# EasyEDA Pro project ProPrj_多模式音乐互动旋转控制系统设计_2026-04-17.epro

# Schematic Schematic1
Assembly Variant: Basic; Board Name: Board1; Create Date: 2026-04-17; Page Name: P1; Project Name: 多模式音乐互动旋转控制系统设计; Schematic Name: Schematic1; Update Date: 2026-04-17; BladeWidth: 10; Company: 嘉立创EDA; Page Size: A4; RegionStart: 1; ShowBorder: 1; TitleBlock: 1; TitleBlockPosition: 3; Version: V1.0; XRegionCount: 6; YRegionCount: 4
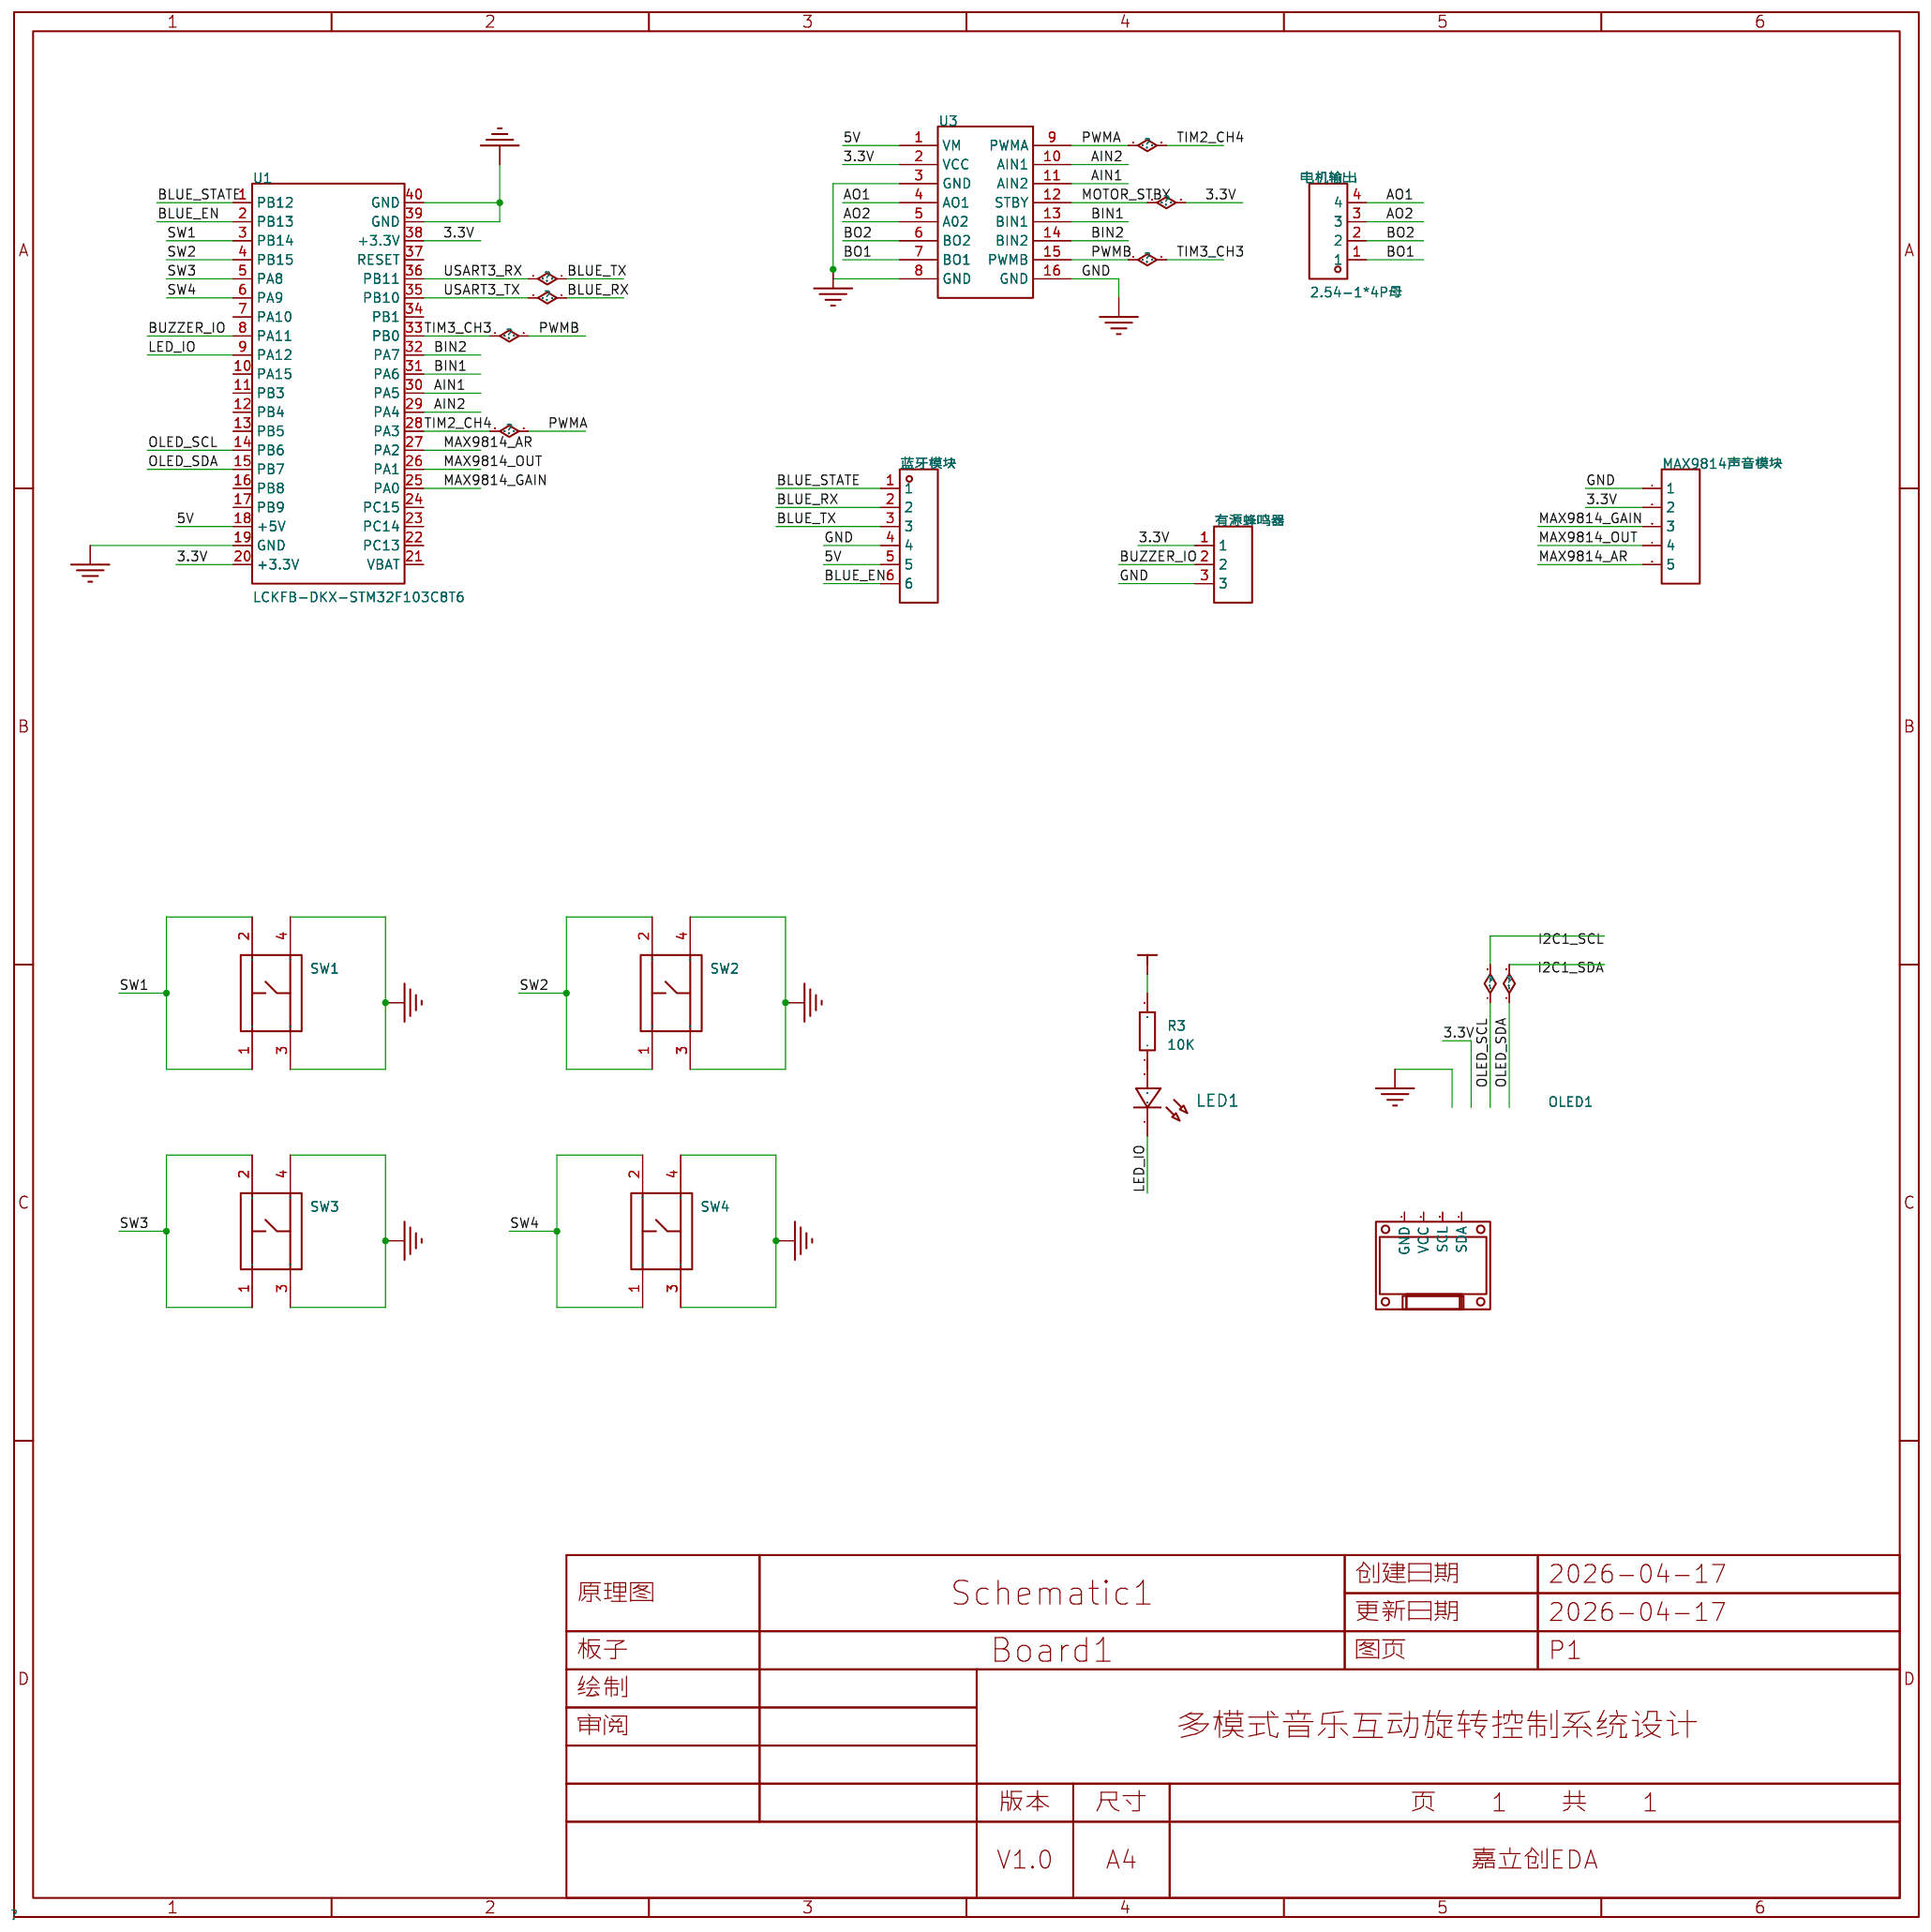
[diagram p0: schematic sheet]

## Parts
LED1  -  [LED_0805]
MAX9814声音模块  -  [HDR-TH_5P-P2.54-V-F]
OLED1  -  [0.96OLED_4P]
R3  10K  [R0805]
SW1  K2-1102DP-C4SW-04  [KEY-TH_4P-L6.0-W6.0-P4.50-LS6.50]
SW2  K2-1102DP-C4SW-04  [KEY-TH_4P-L6.0-W6.0-P4.50-LS6.50]
SW3  K2-1102DP-C4SW-04  [KEY-TH_4P-L6.0-W6.0-P4.50-LS6.50]
SW4  K2-1102DP-C4SW-04  [KEY-TH_4P-L6.0-W6.0-P4.50-LS6.50]
U1  LCKFB-DKX-STM32F103C8T6  [CONN-TH_L53.3-W22.9_STM32F103C8T6-CARD]
U3  -  [TB6612]
有源蜂鸣器  PM254V-11-03-H85  [HDR-TH_3P-P2.54-V-F]
电机输出  2.54-1*4P母  [HDR-TH_4P-P2.54-V-F]
蓝牙模块  -  [HDR-TH_6P-P2.54-V-F]

## Library data of the parts
LED1 = LED_0805-R: Supplier Footprint: 0805
MAX9814声音模块 = HDR-F_2.54_1x5P: Supplier Part: C50950; Supplier Footprint: 插件
OLED1 = 0.96OLED模块_4P: Supplier Footprint: 插件
R3 = Res_0805: Supplier Footprint: 0805
SW1-SW4 = K2-1102DP-C4SW-04: 电路结构:单刀单掷;按钮形状:圆形按钮;作用力:2.5N;安装方式:直插;开关长度:6mm;开关宽度:6mm;开关高度:5mm;触点电流:50mA;额定电压:12V;带灯:-;工作寿命:10万次;; LCSC Part Name: 轻触按键开关6*6*5; Supplier Part: C110153; Manufacturer: 韩国韩荣; Supplier Footprint: 插件-4P,6x6mm; JLCPCB Part Class: Extended Part; Datasheet: https://item.szlcsc.com/datasheet/K2-1102DP-C4SW-04/111374.html; Supplier: LCSC; Circuit: 单刀单掷; Actuator Style: 圆形按钮; Operating Force: 2.5N; Mounting Type: 直插; Length: 6mm; Width: 6mm; Switch Height: 5mm; Contact Current: 50mA; Voltage Rating: 12V; Life: 10万次; Operating Temperature: -25℃~+85℃
U1 = LCKFB-DKX-STM32F103C8T6: 搭载Contex M3内核,程序存储容量64KB,RAM总容量20KB,最高72MHz主频,提供高效的计算能力和稳定的运行环境。; LCSC Part Name: 立创·地阔星-STM32F103C8T6开发板; Supplier Part: C22396880; Manufacturer: 立创开发板; JLCPCB Part Class: Extended Part; Datasheet: https://item.szlcsc.com/datasheet/LCKFB-DKX-STM32F103C8T6/24005615.html; Supplier: LCSC
U3 = TB6612
有源蜂鸣器 = PM254V-11-03-H85: 插孔结构:1x3P;间距:2.54mm;行距:-;圆孔/方孔:方孔;安装方式:直插;排数:单排;总孔位数:3P;额定电流:3A;插孔方向:顶部;塑高:8.5mm;触头材质:黄铜;触头镀层:-;工作温度:-40℃~+105℃;; LCSC Part Name: 1x3P 间距:2.54mm 直插; Supplier Part: C541850; Manufacturer: XFCN(兴飞); Supplier Footprint: 插件,P=2.54mm; JLCPCB Part Class: Extended Part; Datasheet: https://item.szlcsc.com/datasheet/PM254V-11-03-H85/562471.html; Supplier: LCSC; Holes Structure: 1x3P; Pitch: 2.54mm; Circular Hole / Square Hole: 方孔; Mounting Type: 直插; Number of Rows: 单排; Number of Positions: 3P; Current Rating: 3A; Holes Direction: 顶部; Insulation Height: 8.5mm; Contact Material: 黄铜; Operating Temperature: -40℃~+105℃
电机输出 = 2.54-1*4P母: 插孔结构:1x4P;间距:2.54mm;行距:-;圆孔/方孔:方孔;安装方式:直插;排数:单排;总孔位数:4P;额定电流:3A;额定电压:-;插孔方向:顶部;塑高:-;触头材质:青铜;触头镀层:-;工作温度:-40℃~+105℃;; LCSC Part Name: 间距:2.54mm 1x4P 直插; Supplier Part: C2718488; Manufacturer: BOOMELE(博穆精密); Supplier Footprint: 插件,P=2.54mm; JLCPCB Part Class: Extended Part; Datasheet: https://item.szlcsc.com/datasheet/2.54-1*4P%25E6%25AF%258D/2834502.html; Supplier: LCSC; Holes Structure: 1x4P; Pitch: 2.54mm; Circular Hole / Square Hole: 方孔; Mounting Type: 直插; Number of Rows: 单排; Number of Positions: 4P; Current Rating: 3A; Holes Direction: 顶部; Contact Material: 青铜; Operating Temperature: -40℃~+105℃
蓝牙模块 = HDR-F_2.54_1x6P: Supplier Part: C40877; Supplier Footprint: 插件

## Nets
3.3V: MAX9814声音模块.2 R3.2 U1.20(+3.3V) U1.38(+3.3V) U3.2(VCC) U3.12(STBY) 有源蜂鸣器.1
5V: U1.18(+5V) U3.1(VM) 蓝牙模块.5
GND: MAX9814声音模块.1 SW1.3 SW1.4 SW2.3 SW2.4 SW3.3 SW3.4 SW4.3 SW4.4 U1.19(GND) U1.39(GND) U1.40(GND) U3.3(GND) U3.8(GND) U3.16(GND) 有源蜂鸣器.3 蓝牙模块.4
AIN1: U1.30(PA5) U3.11(AIN2)
AIN2: U1.29(PA4) U3.10(AIN1)
AO1: U3.4(AO1) 电机输出.4
AO2: U3.5(A02) 电机输出.3
BIN1: U1.31(PA6) U3.13(BIN1)
BIN2: U1.32(PA7) U3.14(BIN2)
BLUE_EN: U1.2(PB13) 蓝牙模块.6
BLUE_RX: U1.35(PB10) 蓝牙模块.2
BLUE_STATE: U1.1(PB12) 蓝牙模块.1
BLUE_TX: U1.36(PB11) 蓝牙模块.3
BO1: U3.7(BO1) 电机输出.1
BO2: U3.6(BO2) 电机输出.2
BUZZER_IO: U1.8(PA11) 有源蜂鸣器.2
I2C1_SCL: U1.14(PB6)
I2C1_SDA: U1.15(PB7)
LED_IO: LED1.1(C) U1.9(PA12)
MAX9814_AR: MAX9814声音模块.5 U1.27(PA2)
MAX9814_GAIN: MAX9814声音模块.3 U1.25(PA0)
MAX9814_OUT: MAX9814声音模块.4 U1.26(PA1)
PWMA: U1.28(PA3) U3.9(PWMA)
PWMB: U1.33(PB0) U3.15(PWMB)
SW1: SW1.1 SW1.2 U1.3(PB14)
SW2: SW2.1 SW2.2 U1.4(PB15)
SW3: SW3.1 SW3.2 U1.5(PA8)
SW4: SW4.1 SW4.2 U1.6(PA9)
$1N49: LED1.2(A) R3.1

Not connected (* = marked no-connect by the designer): OLED1 1(GND) 2(VCC) 3(SCL) 4(SDA); U1 7(PA10) 10(PA15) 11(PB3) 12(PB4) 13(PB5) 16(PB8) 17(PB9) 21(VBAT) 22(PC13) 23(PC14) 24(PC15) 34(PB1) 37(RESET)

# Board PCB1
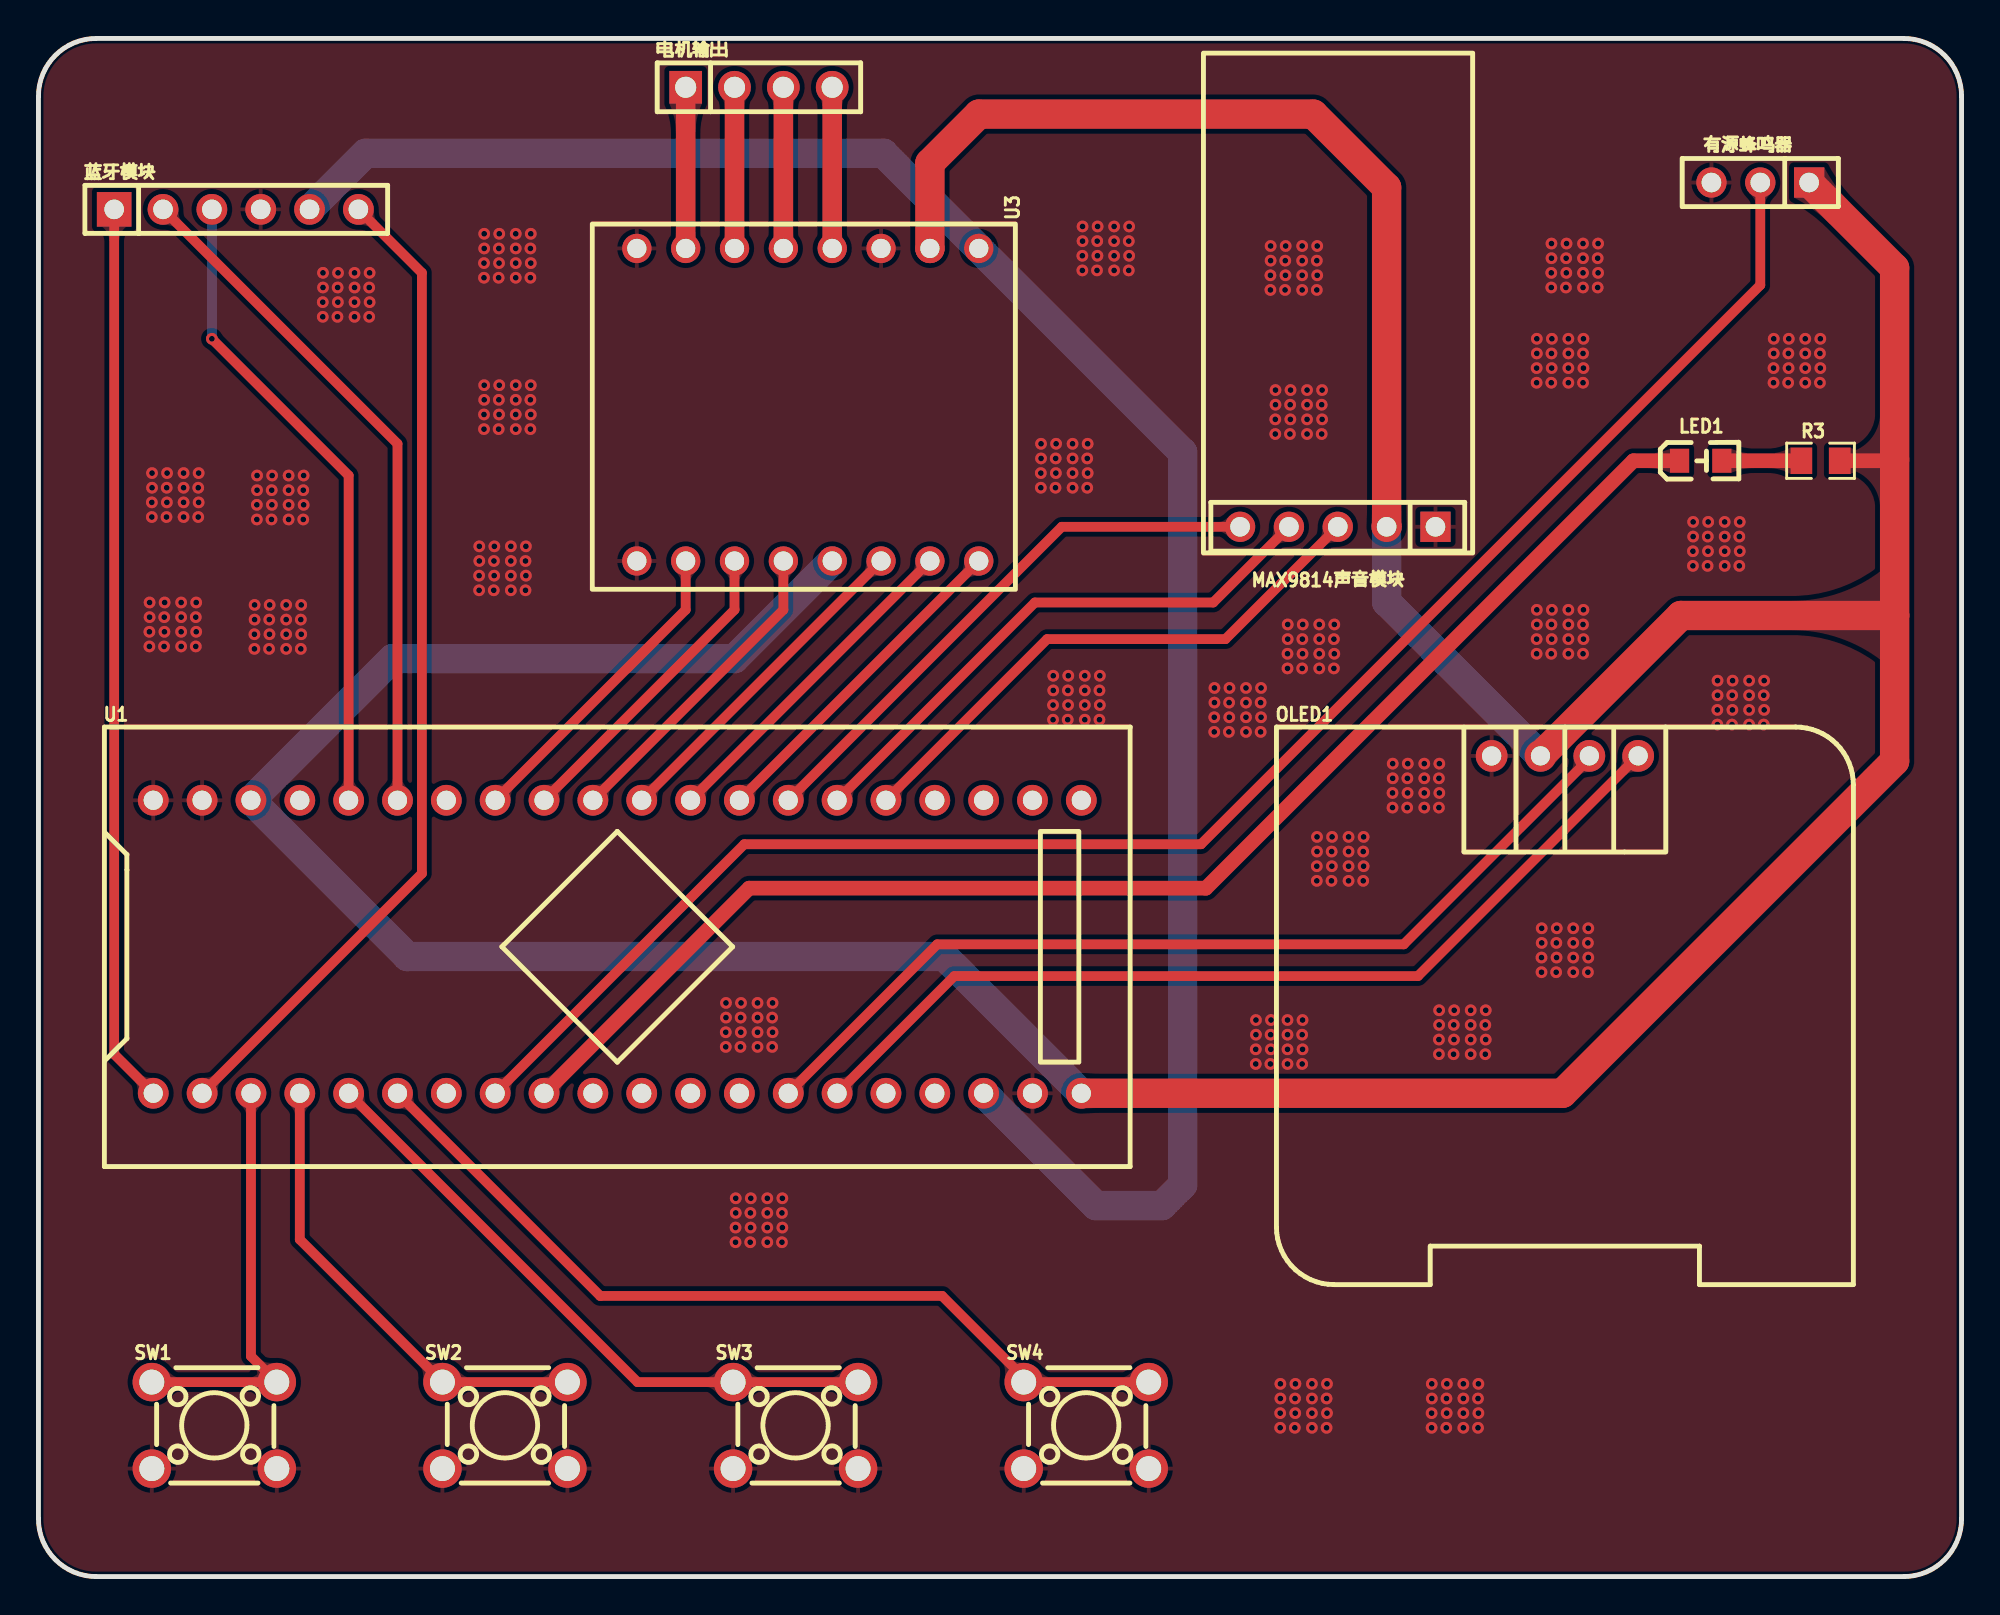
[diagram p1: board, top side]
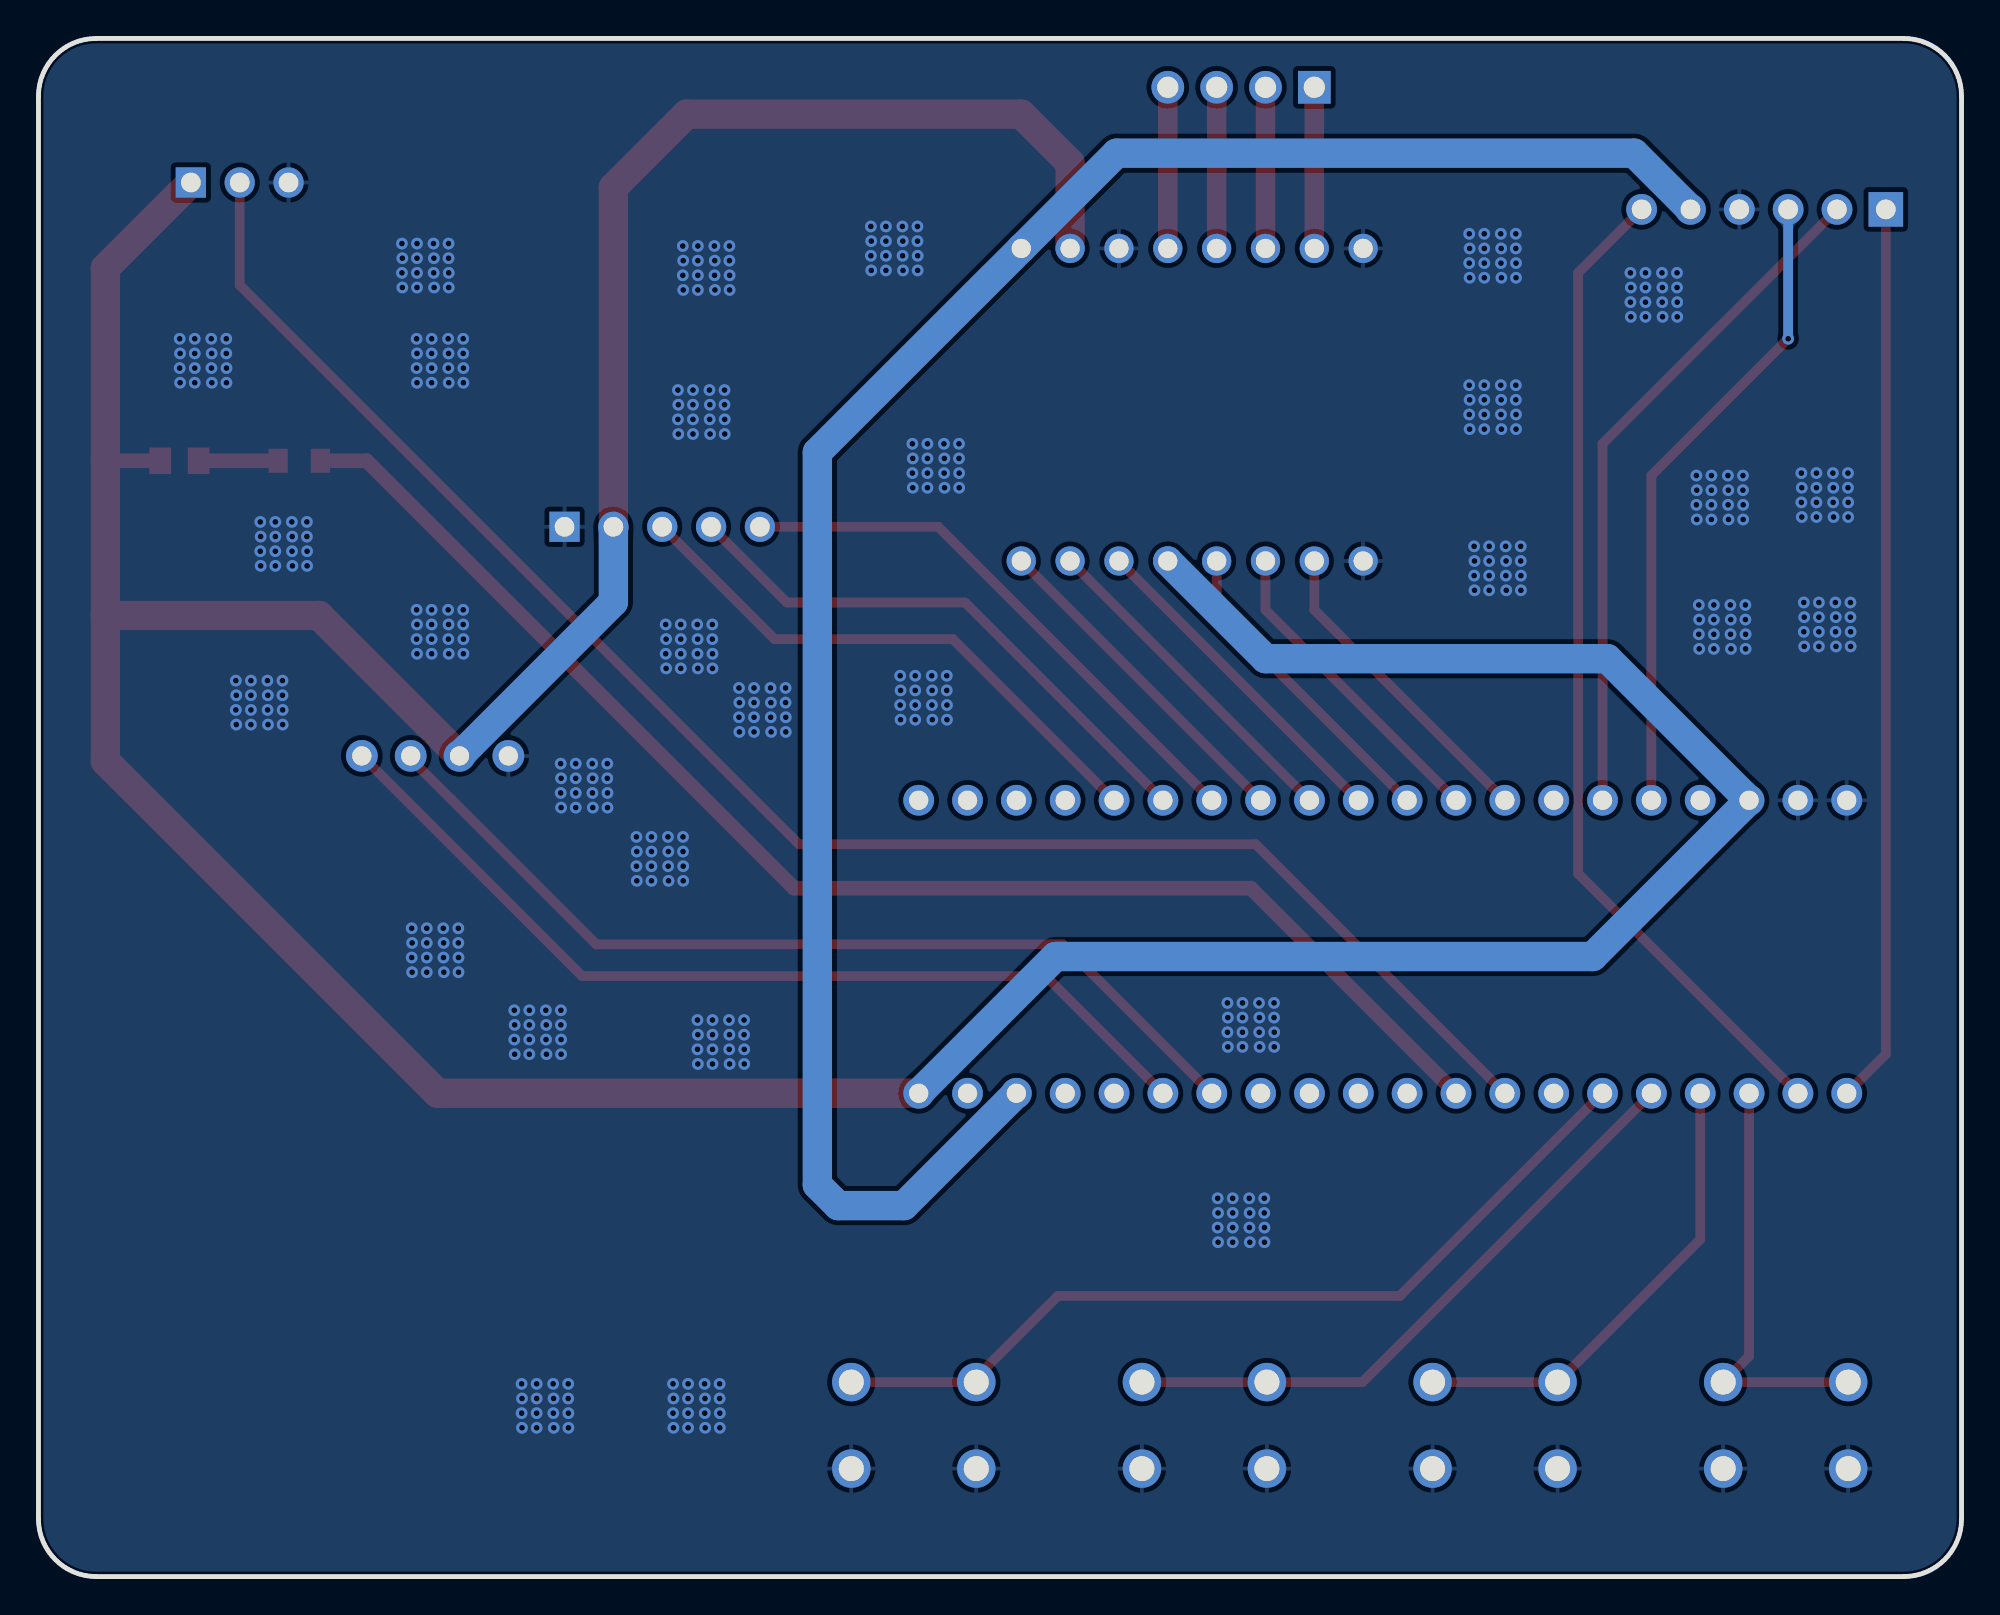
[diagram p2: board, bottom side, seen from below]

Outline 100 x 80 mm; copper layers: Top Layer, Bottom Layer. Coordinates in mm from the lower left corner of the outline.
Outline path: 0,77 0,3 arc(0.88,0.88) 3,0 97,0 arc(99.12,0.88) 100,3 100,77 arc(99.12,79.12) 97,80 3,80 arc(0.88,79.12) 0,77
Stack: Top Layer 0.035mm / Dielectric1 1.51mm FR4 er 4.5 / Bottom Layer 0.035mm

## Design rules (mm)
spacing copperThickness1oz (default): track to track 0.102, other pairs 0.152 to 0.3
spacing copperThickness2oz: track to track 0.203, other pairs 0.152 to 0.3
track width copperThickness1oz (default): min 0.127, default 0.254, max 2.54
track width copperThickness2oz: min 0.203, default 0.254, max 2.54
differential pair differentialPair (default): width min 0.127, default 0.254, max 2.54; gap min 0.152, default 0.152
net GND uses copperRegion

## Placement (name value [footprint] x y rotation side)
LED1  -  [LED_0805]  86.49 58.03 0 top
MAX9814声音模块  -  [HDR-TH_5P-P2.54-V-F]  67.56 54.6 180 top
OLED1  -  [0.96OLED_4P]  79.38 42.68 0 top
R3  10K  [R0805]  92.67 58.03 0 top
SW1  K2-1102DP-C4SW-04  [KEY-TH_4P-L6.0-W6.0-P4.50-LS6.50]  9.14 7.86 0 top
SW2  K2-1102DP-C4SW-04  [KEY-TH_4P-L6.0-W6.0-P4.50-LS6.50]  24.26 7.86 0 top
SW3  K2-1102DP-C4SW-04  [KEY-TH_4P-L6.0-W6.0-P4.50-LS6.50]  39.37 7.86 0 top
SW4  K2-1102DP-C4SW-04  [KEY-TH_4P-L6.0-W6.0-P4.50-LS6.50]  54.48 7.86 0 top
U1  LCKFB-DKX-STM32F103C8T6  [CONN-TH_L53.3-W22.9_STM32F103C8T6-CARD]  30.1 32.76 0 top
U3  -  [TB6612]  50.8 70.35 270 top
有源蜂鸣器  PM254V-11-03-H85  [HDR-TH_3P-P2.54-V-F]  89.53 72.51 180 top
电机输出  2.54-1*4P母  [HDR-TH_4P-P2.54-V-F]  37.47 77.46 0 top
蓝牙模块  -  [HDR-TH_6P-P2.54-V-F]  10.29 71.11 0 top

## Footprints (pads in the part's own frame, mm; a bottom-side part is the same pattern mirrored in y, then rotated)
0.96OLED_4P
  round 1.65 hole 1: 1(-3.81,-0.002) 2(-1.27,0.002) 3(1.27,0.002) 4(3.81,0.002)
CONN-TH_L53.3-W22.9_STM32F103C8T6-CARD
  round 1.6 hole 1: 1(-24.13,-7.62) 2(-21.59,-7.62) 3(-19.05,-7.62) 4(-16.51,-7.62) 5(-13.97,-7.62) 6(-11.43,-7.62) 7(-8.89,-7.62) 8(-6.35,-7.62) 9(-3.81,-7.62) 10(-1.27,-7.62) 11(1.27,-7.62) 12(3.81,-7.62) 13(6.35,-7.62) 14(8.89,-7.62) 15(11.43,-7.62) 16(13.97,-7.62) 17(16.51,-7.62) 18(19.05,-7.62) 19(21.59,-7.62) 20(24.13,-7.62) 21(24.13,7.62) 22(21.59,7.62) 23(19.05,7.62) 24(16.51,7.62) 25(13.97,7.62) 26(11.43,7.62) 27(8.89,7.62) 28(6.35,7.62) 29(3.81,7.62) 30(1.27,7.62) 31(-1.27,7.62) 32(-3.81,7.62) 33(-6.35,7.62) 34(-8.89,7.62) 35(-11.43,7.62) 36(-13.97,7.62) 37(-16.51,7.62) 38(-19.05,7.62) 39(-21.59,7.62) 40(-24.13,7.62)
HDR-TH_3P-P2.54-V-F
  rect 1.575x1.575 hole 1.02: 1(-2.54,0)
  round 1.575 hole 1.02: 2(0,0) 3(2.54,0)
HDR-TH_4P-P2.54-V-F
  rect 1.7x1.7 hole 1.1: 1(-3.81,0)
  round 1.7 hole 1.1: 2(-1.27,0) 3(1.27,0) 4(3.81,0)
HDR-TH_5P-P2.54-V-F
  rect 1.575x1.575 hole 1.02: 1(-5.08,0)
  round 1.575 hole 1.02: 2(-2.54,0) 3(0,0) 4(2.54,0) 5(5.08,0)
HDR-TH_6P-P2.54-V-F
  rect 1.8x1.8 hole 1.02: 1(-6.35,0)
  round 1.6 hole 1.02: 2(-3.81,0) 3(-1.27,0) 4(1.27,0) 5(3.81,0) 6(6.35,0)
KEY-TH_4P-L6.0-W6.0-P4.50-LS6.50
  round 2 hole 1.3: 1(-3.25,2.25) 2(3.25,2.25) 3(-3.25,-2.25) 4(3.25,-2.25)
LED_0805
  rect 1x1.25 smd: 1(-1.15,0.005) 2(1.05,0.005)
R0805
  rect 1.133x1.377 smd: 1(-1,0) 2(1,0)
TB6612
  round 1.524 hole 1: 1(1.27,-1.905) 2(1.27,-4.445) 3(1.27,-6.985) 4(1.27,-9.525) 5(1.27,-12.065) 6(1.27,-14.605) 7(1.27,-17.145) 8(1.27,-19.685) 9(17.526,-1.905) 10(17.526,-4.445) 11(17.526,-6.985) 12(17.526,-9.525) 13(17.526,-12.065) 14(17.526,-14.605) 15(17.526,-17.145) 16(17.526,-19.685)

## Nets
As in the schematic, except:
3.3V: MAX9814声音模块.2 OLED1.2 R3.2 U1.20 U1.38 U3.2 U3.12 有源蜂鸣器.1
GND: MAX9814声音模块.1 OLED1.1 SW1.3 SW1.4 SW2.3 SW2.4 SW3.3 SW3.4 SW4.3 SW4.4 U1.19 U1.39 U1.40 U3.3 U3.8 U3.16 有源蜂鸣器.3 蓝牙模块.4
I2C1_SCL: OLED1.3 U1.14
I2C1_SDA: OLED1.4 U1.15

Pads without a net: U1 7 10 11 12 13 16 17 21 22 23 24 34 37

## Via types
v1: diameter 0.61, hole 0.305, Top Layer to Bottom Layer, 481 vias

## Routing (per net, layer and track width the routed paths; a pad name or vN(x,y) marks a point on that pad's centre or on a via; arc(x,y) is an arc through that point)
3.3V: length 254.3
  Top Layer w0.762: 96.52,58.1 96.46,58.03 R3.2
  Top Layer w1.524: OLED1.2 85.41,49.99 96.52,49.99 ; U3.2 46.35,73.52 48.9,76.06 66.29,76.06 70.1,72.25 MAX9814声音模块.2 ; 有源蜂鸣器.1 96.52,68.06 96.52,49.99 ; 96.52,49.99 96.52,42.41 79.25,25.14 U1.20
  Bottom Layer w1.524: U3.12 36.19,47.74 18.42,47.74 U1.38 19.18,32.25 47.12,32.25 U1.20 ; OLED1.2 70.1,50.69 MAX9814声音模块.2
5V: length 104.4
  Bottom Layer w1.524: 14.1,71.11 17.02,74.03 43.94,74.03 U3.1 59.5,58.48 59.5,20.37 58.42,19.29 54.99,19.29 U1.18
GND:
  vias: v1(5.78,50.66) v1(5.78,49.9) v1(5.77,49.14) v1(5.77,48.38) v1(5.91,57.39) v1(5.91,56.63) v1(5.89,55.87) v1(5.89,55.11) v1(6.54,49.9) v1(6.53,48.38) v1(6.56,50.66) v1(6.55,49.14) v1(6.69,57.39) v1(6.67,56.63) v1(6.68,55.87) v1(6.66,55.11) v1(7.42,50.66) v1(7.42,49.9) v1(7.42,49.14) v1(7.42,48.38) v1(7.55,57.39) v1(7.55,56.63) v1(7.55,55.87) v1(7.55,55.11) v1(8.2,50.66) v1(8.18,49.9) v1(8.2,49.14) v1(8.18,48.38) v1(8.33,57.39) v1(8.31,56.63) v1(8.33,55.87) v1(8.31,55.11) v1(11.24,50.54) v1(11.24,49.77) v1(11.23,49.01) v1(11.23,48.25) v1(11.37,57.27) v1(11.37,56.5) v1(11.36,55.74) v1(11.36,54.98) v1(12.02,50.54) v1(12,49.77) v1(12.01,49.01) v1(11.99,48.25) v1(12.15,57.27) v1(12.13,56.5) v1(12.14,55.74) v1(12.12,54.98) v1(12.88,50.54) v1(12.88,49.77) v1(12.88,49.01) v1(12.88,48.25) v1(13.01,57.27) v1(13.01,56.5) v1(13.01,55.74) v1(13.01,54.98) v1(13.64,49.77) v1(13.64,48.25) v1(13.66,50.54) v1(13.66,49.01) v1(13.79,57.27) v1(13.77,56.5) v1(13.79,55.74) v1(13.77,54.98) v1(14.8,67.81) v1(14.8,67.05) v1(14.78,66.28) v1(14.78,65.52) v1(15.55,65.52) v1(15.58,67.81) v1(15.56,67.05) v1(15.57,66.28) v1(16.44,67.81) v1(16.44,67.05) v1(16.44,66.28) v1(16.44,65.52) v1(17.22,67.81) v1(17.2,67.05) v1(17.22,66.28) v1(17.2,65.52) v1(22.92,53.58) v1(22.92,52.82) v1(22.91,52.06) v1(22.91,51.3) v1(23.18,69.84) v1(23.18,69.08) v1(23.17,68.32) v1(23.17,67.55) v1(23.18,61.97) v1(23.18,61.2) v1(23.17,60.44) v1(23.17,59.68) v1(23.71,53.58) v1(23.69,52.82) v1(23.7,52.06) v1(23.67,51.3) v1(23.94,69.08) v1(23.93,67.55) v1(23.94,61.2) v1(23.93,59.68) v1(23.96,69.84) v1(23.95,68.32) v1(23.96,61.97) v1(23.95,60.44) v1(24.56,53.58) v1(24.56,52.82) v1(24.56,52.06) v1(24.56,51.3) v1(24.82,69.84) v1(24.82,69.08) v1(24.82,68.32) v1(24.82,67.55) v1(24.82,61.97) v1(24.82,61.2) v1(24.82,60.44) v1(24.82,59.68) v1(25.35,53.58) v1(25.33,52.82) v1(25.35,52.06) v1(25.33,51.3) v1(25.6,69.84) v1(25.58,69.08) v1(25.6,68.32) v1(25.58,67.55) v1(25.6,61.97) v1(25.58,61.2) v1(25.6,60.44) v1(25.58,59.68) v1(35.74,28.31) v1(35.74,27.55) v1(35.75,29.83) v1(35.75,29.07) v1(36.25,18.15) v1(36.25,17.39) v1(36.26,19.68) v1(36.26,18.91) v1(36.53,29.83) v1(36.51,29.07) v1(36.52,28.31) v1(36.5,27.55) v1(37.04,19.68) v1(37.02,18.91) v1(37.03,18.15) v1(37.01,17.39) v1(37.39,29.83) v1(37.39,29.07) v1(37.39,28.31) v1(37.39,27.55) v1(37.9,19.68) v1(37.9,18.91) v1(37.9,18.15) v1(37.9,17.39) v1(38.17,29.83) v1(38.15,29.07) v1(38.17,28.31) v1(38.15,27.55) v1(38.68,19.68) v1(38.66,18.91) v1(38.68,18.15) v1(38.66,17.39) v1(52.13,58.92) v1(52.13,58.16) v1(52.12,57.39) v1(52.12,56.63) v1(52.77,46.85) v1(52.77,46.09) v1(52.76,45.33) v1(52.76,44.57) v1(52.92,58.92) v1(52.9,58.16) v1(52.91,57.39) v1(52.88,56.63) v1(53.53,46.09) v1(53.54,45.33) v1(53.52,44.57) v1(53.55,46.85) v1(53.77,58.92) v1(53.77,58.16) v1(53.77,57.39) v1(53.77,56.63) v1(54.29,70.22) v1(54.29,69.46) v1(54.28,68.7) v1(54.28,67.94) v1(54.41,46.85) v1(54.41,46.09) v1(54.41,45.33) v1(54.41,44.57) v1(54.54,58.16) v1(54.54,56.63) v1(54.56,58.92) v1(54.56,57.39) v1(55.04,67.94) v1(55.08,70.22) v1(55.05,69.46) v1(55.06,68.7) v1(55.19,46.85) v1(55.17,46.09) v1(55.19,45.33) v1(55.17,44.57) v1(55.93,70.22) v1(55.93,69.46) v1(55.93,68.7) v1(55.93,67.94) v1(56.72,70.22) v1(56.69,69.46) v1(56.72,68.7) v1(56.69,67.94) v1(61.14,44.69) v1(61.14,43.93) v1(61.15,46.22) v1(61.15,45.46) v1(61.93,46.22) v1(61.91,45.46) v1(61.92,44.69) v1(61.9,43.93) v1(62.79,46.22) v1(62.79,45.46) v1(62.79,44.69) v1(62.79,43.93) v1(63.31,28.95) v1(63.31,28.18) v1(63.3,27.42) v1(63.3,26.66) v1(63.57,46.22) v1(63.55,45.46) v1(63.57,44.69) v1(63.55,43.93) v1(64.07,69.2) v1(64.07,68.44) v1(64.06,67.68) v1(64.06,66.92) v1(64.09,28.95) v1(64.07,28.18) v1(64.08,27.42) v1(64.06,26.66) v1(64.33,61.71) v1(64.33,60.95) v1(64.31,60.19) v1(64.31,59.43) v1(64.58,10.02) v1(64.58,9.26) v1(64.57,8.5) v1(64.57,7.74) v1(64.83,68.44) v1(64.84,67.68) v1(64.82,66.92) v1(64.85,69.2) v1(64.95,48) v1(64.95,47.23) v1(64.95,28.95) v1(64.95,28.18) v1(64.95,27.42) v1(64.95,26.66) v1(64.96,49.52) v1(64.96,48.76) v1(65.11,61.71) v1(65.09,60.95) v1(65.1,60.19) v1(65.08,59.43) v1(65.34,9.26) v1(65.33,7.74) v1(65.36,10.02) v1(65.35,8.5) v1(65.71,69.2) v1(65.71,68.44) v1(65.71,67.68) v1(65.71,66.92) v1(65.74,49.52) v1(65.72,48.76) v1(65.73,48) v1(65.71,47.23) v1(65.73,28.95) v1(65.71,28.18) v1(65.73,27.42) v1(65.71,26.66) v1(65.97,61.71) v1(65.97,60.95) v1(65.97,60.19) v1(65.97,59.43) v1(66.22,10.02) v1(66.22,9.26) v1(66.22,8.5) v1(66.22,7.74) v1(66.5,69.2) v1(66.47,68.44) v1(66.5,67.68) v1(66.47,66.92) v1(66.48,38.47) v1(66.48,37.71) v1(66.47,36.95) v1(66.47,36.19) v1(66.6,49.52) v1(66.6,48.76) v1(66.6,48) v1(66.6,47.23) v1(66.75,61.71) v1(66.73,60.95) v1(66.75,60.19) v1(66.73,59.43) v1(67,10.02) v1(66.98,9.26) v1(67,8.5) v1(66.98,7.74) v1(67.25,37.71) v1(67.24,36.19) v1(67.27,38.47) v1(67.26,36.95) v1(67.38,49.52) v1(67.36,48.76) v1(67.38,48) v1(67.36,47.23) v1(68.12,38.47) v1(68.12,37.71) v1(68.12,36.95) v1(68.12,36.19) v1(68.91,38.47) v1(68.89,37.71) v1(68.91,36.95) v1(68.89,36.19) v1(70.42,42.28) v1(70.42,41.52) v1(70.41,40.76) v1(70.41,40) v1(71.2,42.28) v1(71.18,41.52) v1(71.19,40.76) v1(71.17,40) v1(72.06,42.28) v1(72.06,41.52) v1(72.06,40.76) v1(72.06,40) v1(72.44,8.5) v1(72.44,7.74) v1(72.45,10.02) v1(72.45,9.26) v1(72.84,42.28) v1(72.82,41.52) v1(72.84,40.76) v1(72.82,40) v1(72.83,29.45) v1(72.83,28.69) v1(72.82,27.93) v1(72.82,27.17) v1(73.24,10.02) v1(73.22,9.26) v1(73.23,8.5) v1(73.21,7.74) v1(73.62,29.45) v1(73.6,28.69) v1(73.61,27.93) v1(73.59,27.17) v1(74.09,10.02) v1(74.09,9.26) v1(74.09,8.5) v1(74.09,7.74) v1(74.47,29.45) v1(74.47,28.69) v1(74.47,27.93) v1(74.47,27.17) v1(74.88,10.02) v1(74.86,9.26) v1(74.88,8.5) v1(74.86,7.74) v1(75.24,28.69) v1(75.24,27.17) v1(75.26,29.45) v1(75.26,27.93) v1(77.91,64.38) v1(77.91,63.62) v1(77.9,62.86) v1(77.9,62.09) v1(77.91,50.28) v1(77.91,49.52) v1(77.9,48.76) v1(77.9,48) v1(78.17,33.72) v1(78.17,32.96) v1(78.16,32.19) v1(78.16,31.43) v1(78.68,69.33) v1(78.68,68.57) v1(78.67,67.81) v1(78.67,67.05) v1(78.7,64.38) v1(78.68,63.62) v1(78.69,62.86) v1(78.67,62.09) v1(78.7,50.28) v1(78.68,49.52) v1(78.69,48.76) v1(78.67,48) v1(78.93,32.96) v1(78.94,32.19) v1(78.92,31.43) v1(78.95,33.72) v1(79.44,68.57) v1(79.45,67.81) v1(79.43,67.05) v1(79.46,69.33) v1(79.56,64.38) v1(79.56,63.62) v1(79.56,62.86) v1(79.56,62.09) v1(79.56,50.28) v1(79.56,49.52) v1(79.56,48.76) v1(79.56,48) v1(79.81,33.72) v1(79.81,32.96) v1(79.81,32.19) v1(79.81,31.43) v1(80.32,69.33) v1(80.32,68.57) v1(80.32,67.81) v1(80.32,67.05) v1(80.34,64.38) v1(80.32,63.62) v1(80.34,62.86) v1(80.32,62.09) v1(80.34,50.28) v1(80.32,49.52) v1(80.34,48.76) v1(80.32,48) v1(80.59,33.72) v1(80.57,32.96) v1(80.59,32.19) v1(80.57,31.43) v1(81.1,69.33) v1(81.08,68.57) v1(81.1,67.81) v1(81.08,67.05) v1(86.04,54.85) v1(86.04,54.09) v1(86.03,53.33) v1(86.03,52.57) v1(86.83,54.85) v1(86.8,54.09) v1(86.81,53.33) v1(86.79,52.57) v1(87.31,46.6) v1(87.31,45.84) v1(87.3,45.08) v1(87.3,44.31) v1(87.68,54.85) v1(87.68,54.09) v1(87.68,53.33) v1(87.68,52.57) v1(88.1,46.6) v1(88.07,45.84) v1(88.09,45.08) v1(88.06,44.31) v1(88.44,54.09) v1(88.44,52.57) v1(88.47,54.85) v1(88.47,53.33) v1(88.95,46.6) v1(88.95,45.84) v1(88.95,45.08) v1(88.95,44.31) v1(89.74,46.6) v1(89.72,45.84) v1(89.74,45.08) v1(89.72,44.31) v1(90.23,64.38) v1(90.23,63.62) v1(90.22,62.86) v1(90.22,62.09) v1(91.02,64.38) v1(91,63.62) v1(91.01,62.86) v1(90.99,62.09) v1(91.87,64.38) v1(91.87,63.62) v1(91.87,62.86) v1(91.87,62.09) v1(92.64,63.62) v1(92.64,62.09) v1(92.66,64.38) v1(92.66,62.86)
AIN1: length 17.6
  Top Layer w0.508: U1.30 U3.11
AIN2: length 17.6
  Top Layer w0.508: U1.29 U3.10
AO1: length 8.4
  Top Layer w1.016: 电机输出.4 U3.4
AO2: length 8.4
  Top Layer w1.016: 电机输出.3 U3.5
BIN1: length 16.5
  Top Layer w0.508: 28.83,40.38 38.74,50.28 U3.13
BIN2: length 16.5
  Top Layer w0.508: U1.32 36.19,50.28 U3.14
BLUE_EN: length 52.1
  Top Layer w0.508: U1.2 19.94,36.57 19.94,67.81 蓝牙模块.6
BLUE_RX: length 35.8
  Top Layer w0.508: 蓝牙模块.2 18.67,58.92 U1.35
BLUE_STATE: length 46.8
  Top Layer w0.508: 3.94,71.11 3.94,27.17 U1.1
BLUE_TX: length 33.7
  Top Layer w0.508: v1(9.02,64.38) 16.13,57.27 U1.36
  Bottom Layer w0.508: v1(9.02,64.38) 9.02,71.11
BO1: length 8.4
  Top Layer w1.016: 电机输出.1 U3.7
BO2: length 8.4
  Top Layer w1.016: U3.6 电机输出.2
BUZZER_IO: length 88.5
  Top Layer w0.508: U1.8 36.7,38.09 60.45,38.09 89.53,67.17 有源蜂鸣器.2
I2C1_SCL: length 49
  Top Layer w0.508: U1.14 46.74,32.88 70.99,32.88 80.65,42.53 OLED1.3
I2C1_SDA: length 48.9
  Top Layer w0.508: OLED1.4 71.73,31.23 47.62,31.23 U1.15
LED_IO: length 72.7
  Top Layer w0.762: LED1.1 82.94,58.03 60.71,35.8 36.96,35.8 U1.9
MAX9814_AR: length 29.4
  Top Layer w0.508: MAX9814声音模块.5 53.21,54.6 U1.27
MAX9814_GAIN: length 29.4
  Top Layer w0.508: MAX9814声音模块.3 61.72,48.76 52.45,48.76 U1.25
MAX9814_OUT: length 29.4
  Top Layer w0.508: MAX9814声音模块.4 61.09,50.66 51.82,50.66 U1.26
PWMA: length 17.6
  Top Layer w0.508: U1.28 U3.9
PWMB: length 16.5
  Top Layer w0.508: U3.15 33.66,50.28 U1.33
SW1: length 22.1
  Top Layer w0.508: U1.3 11.05,11.46 SW1.2 SW1.1
SW2: length 24.6
  Top Layer w0.508: SW2.2 SW2.1 13.59,17.53 U1.4
SW3: length 32.7
  Top Layer w0.508: SW3.2 SW3.1 31.15,10.11 U1.5
SW4: length 45.4
  Top Layer w0.508: SW4.2 SW4.1 51.23,10.35 46.99,14.59 29.21,14.59 U1.6
$1N49: length 4.1
  Top Layer w0.762: LED1.2 R3.1

## Copper pours and planes (outline as drawn; the poured copper is in the pictures)
GND on Top Layer: -19.18,100.32 156.59,100.32 156.59,-9.79 -19.18,-9.79
GND on Bottom Layer: -11.68,89.78 121.79,89.78 121.79,-3.31 -11.68,-3.31

Small or netless copper shapes (teardrops, artwork), in the pictures only: 67 on Top Layer, 9 on Bottom Layer
